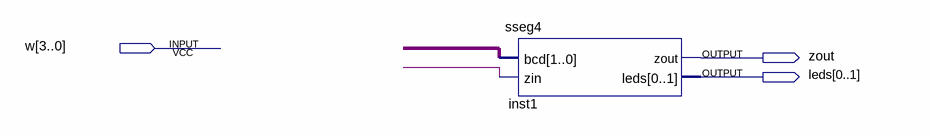
[diagram p0: schematic sheet]
// Quartus schematic encod.bdf as structural Verilog: 1 symbols, 3 pins
module encod (
  input  [3:0] w,
  output zout,
  output [0:1] leds
);

  wire undriven_2;
  wire [1:0] undriven;

  sseg4 inst1 (.bcd(undriven), .zin(undriven_2), .zout(zout), .leds(leds));
endmodule
